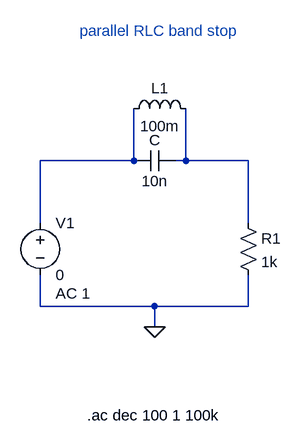
[diagram p0: schematic band_stop_filter1.asc]
band_stop_filter1.asc, the LTspice schematic file:
Version 4
SHEET 1 880 680
WIRE 80 -80 80 -160
WIRE 80 -80 -64 -80
WIRE 160 -80 160 -160
WIRE 160 -80 144 -80
WIRE 256 -80 160 -80
WIRE -64 16 -64 -80
WIRE 256 16 256 -80
WIRE -64 144 -64 96
WIRE 112 144 -64 144
WIRE 256 144 256 96
WIRE 256 144 112 144
WIRE 112 176 112 144
FLAG 112 176 0
SYMBOL voltage -64 0 R0
WINDOW 123 24 124 Left 2
WINDOW 39 0 0 Left 0
SYMATTR InstName V1
SYMATTR Value 0
SYMATTR Value2 AC 1
SYMBOL res 240 0 R0
SYMATTR InstName R1
SYMATTR Value 1k
SYMBOL cap 144 -96 R90
WINDOW 0 0 32 VBottom 2
WINDOW 3 32 32 VTop 2
SYMATTR InstName C
SYMATTR Value 10n
SYMBOL ind 64 -144 R270
WINDOW 0 32 56 VTop 2
WINDOW 3 5 56 VBottom 2
SYMATTR InstName L1
SYMATTR Value 100m
TEXT 120 -280 Center 2 ;parallel RLC band stop
TEXT 8 312 Left 2 !.ac dec 100 1 100k

The netlist it stands for:
* band_stop_filter1.asc
V1 N001 0 0 AC 1
R1 N002 0 1k
C N002 N001 10n
L1 N001 N002 100m
* parallel RLC band stop
.ac dec 100 1 100k
.backanno
.end